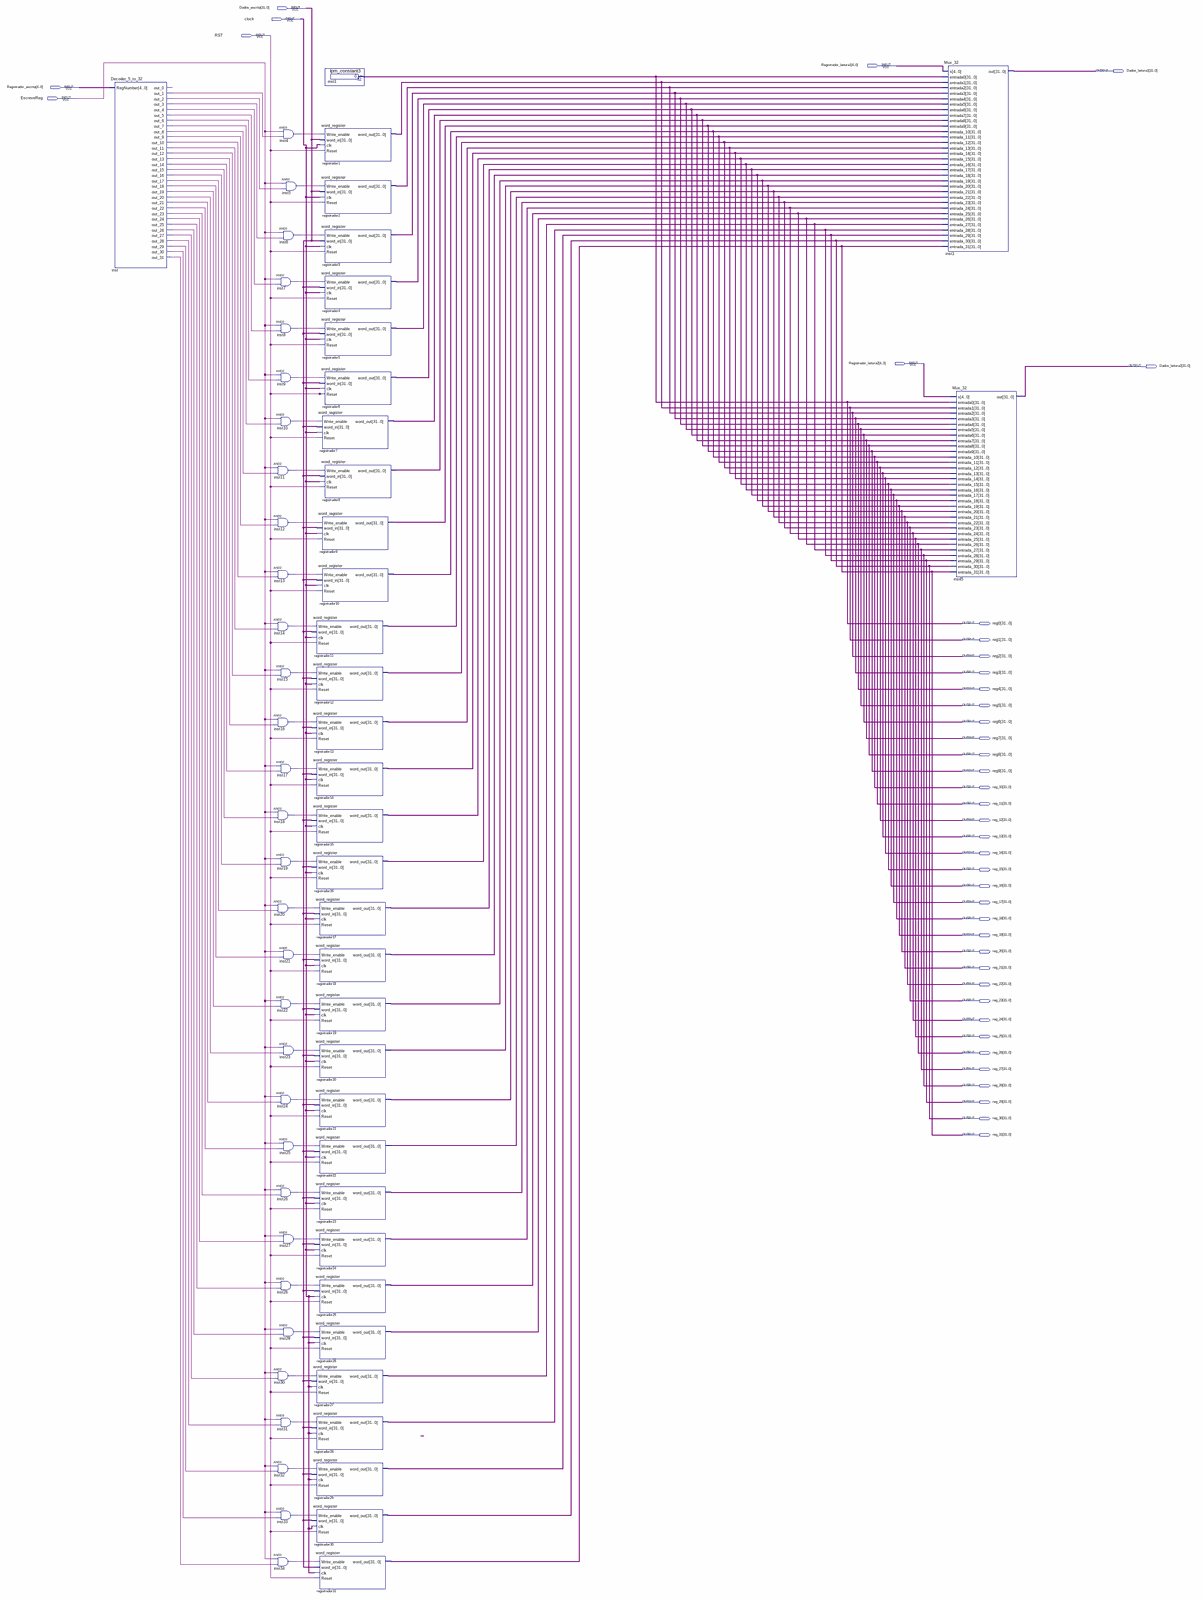
[diagram p0: schematic sheet, whole]
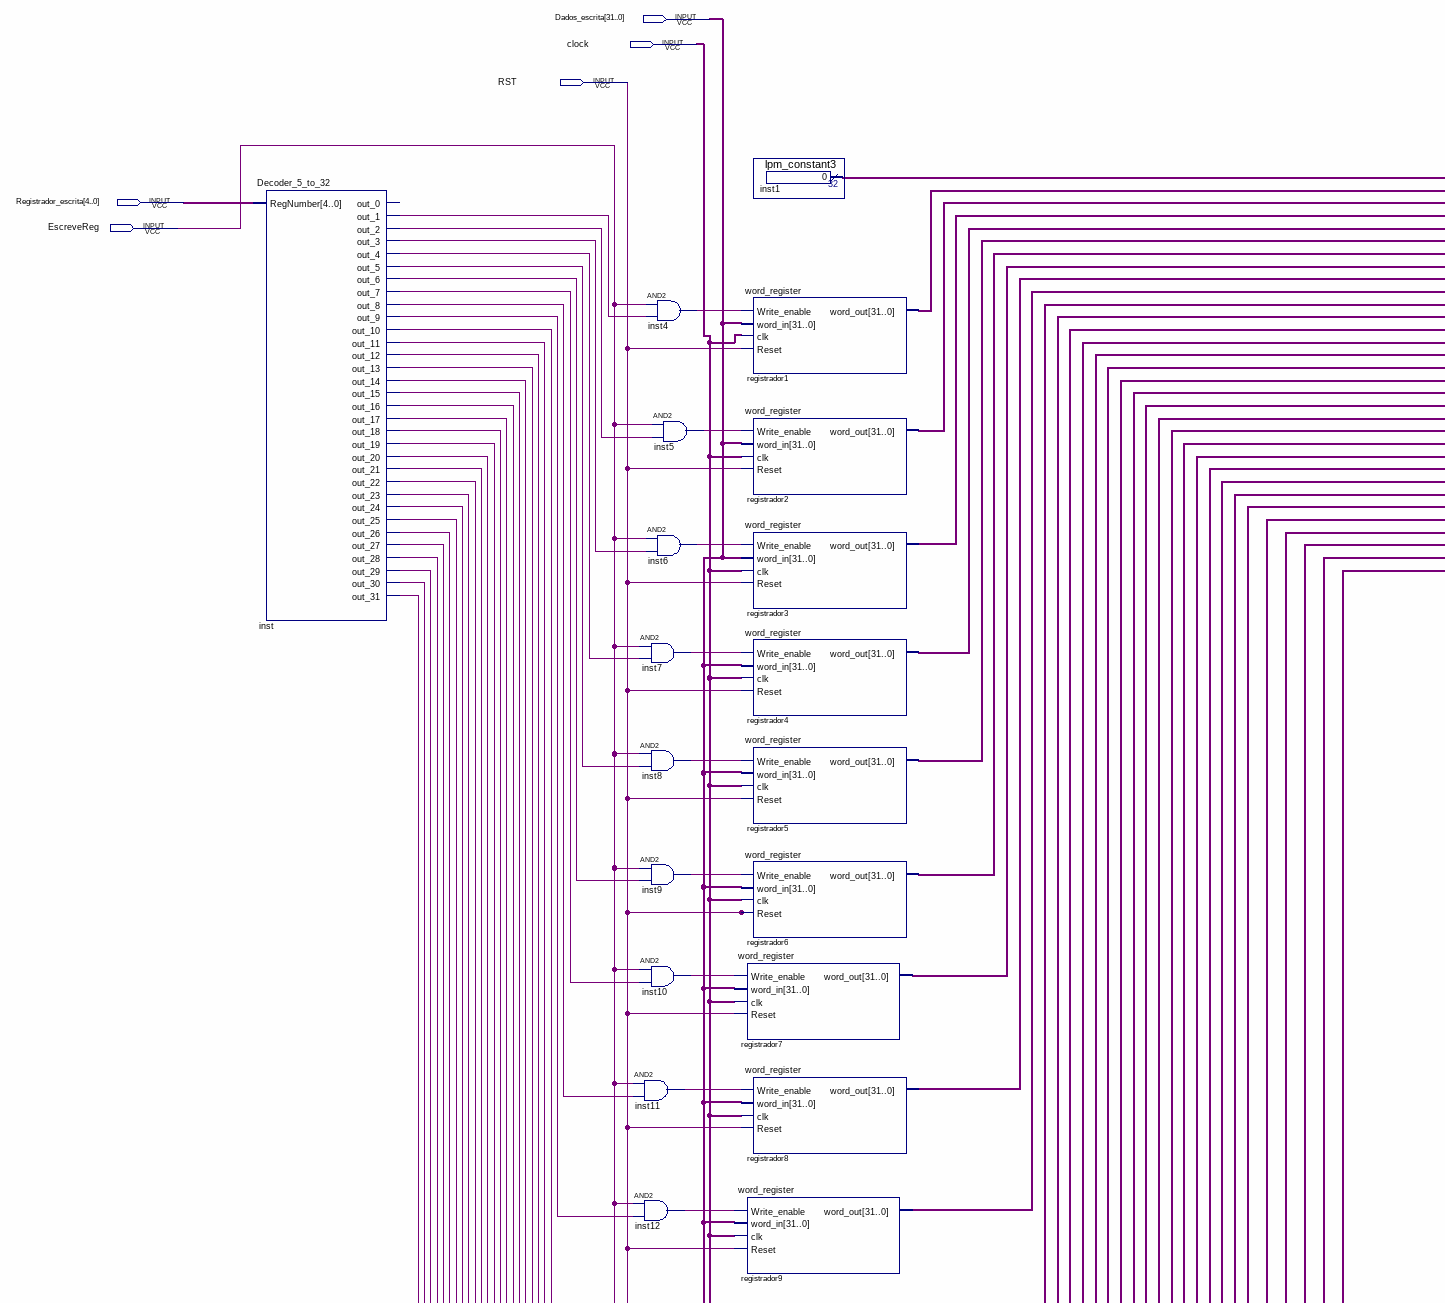
[diagram p1: schematic sheet, upper left part]
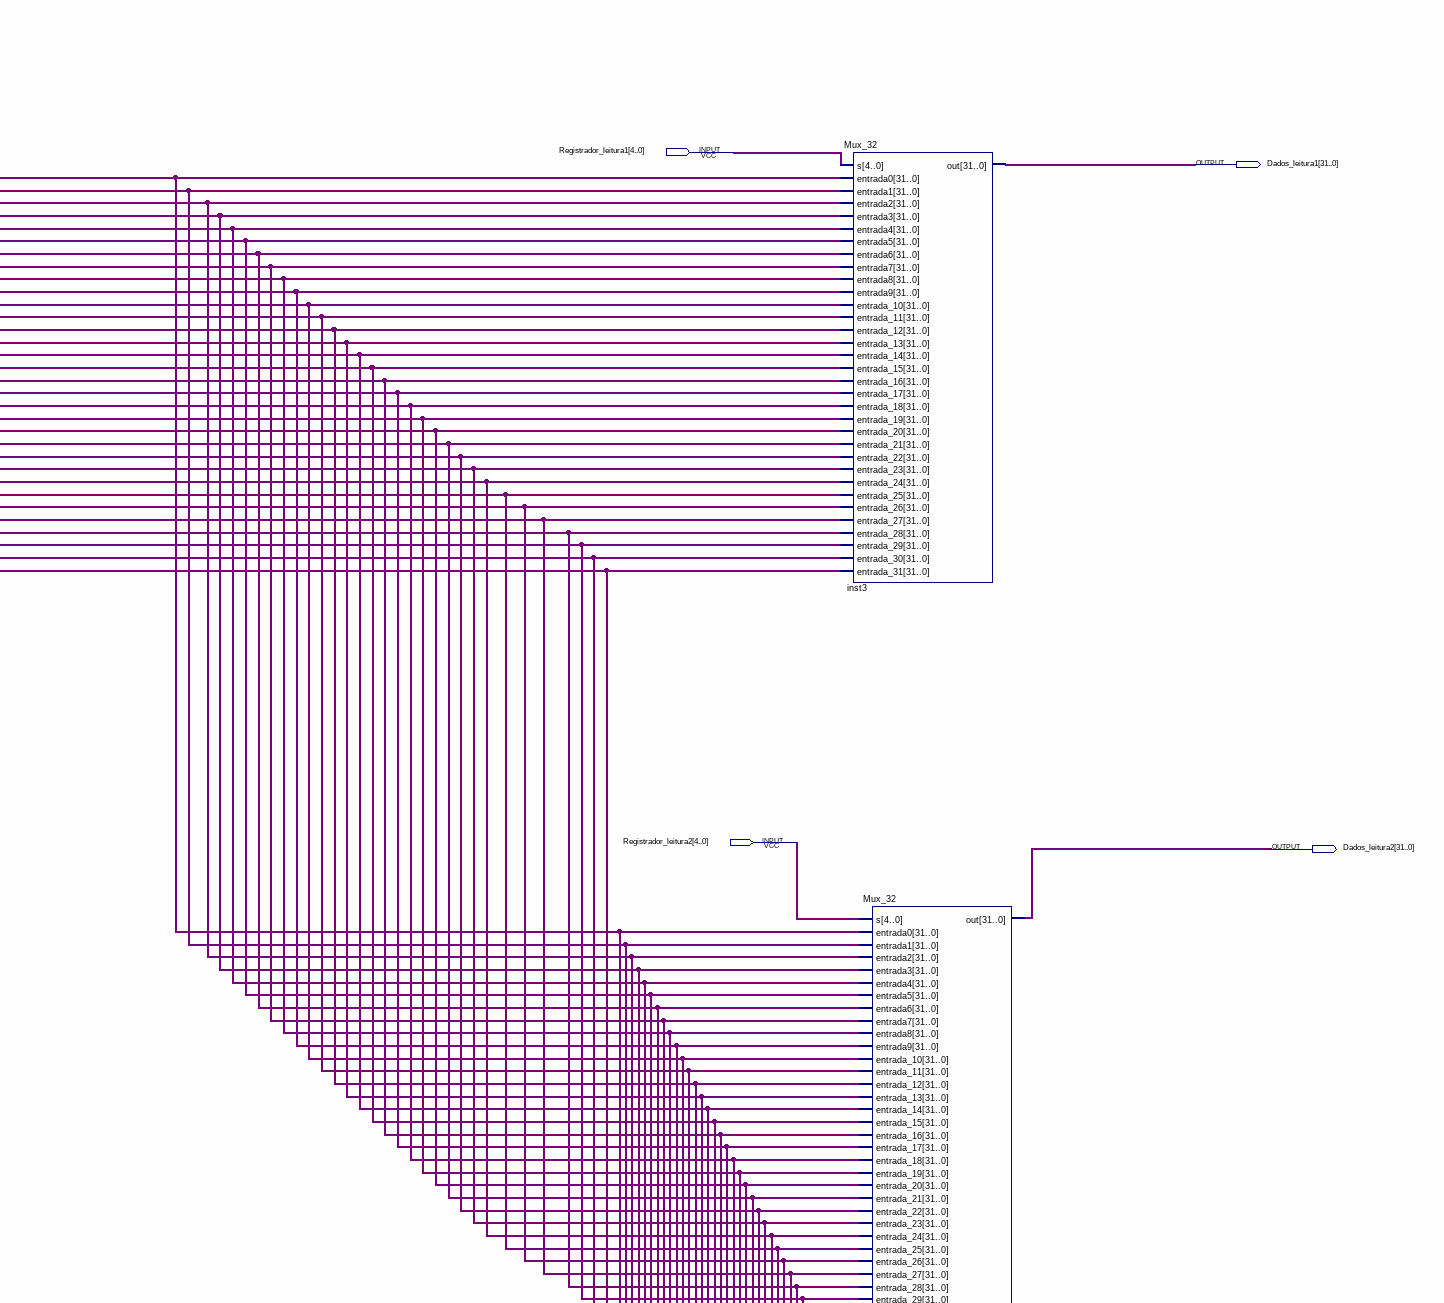
[diagram p2: schematic sheet, upper right part]
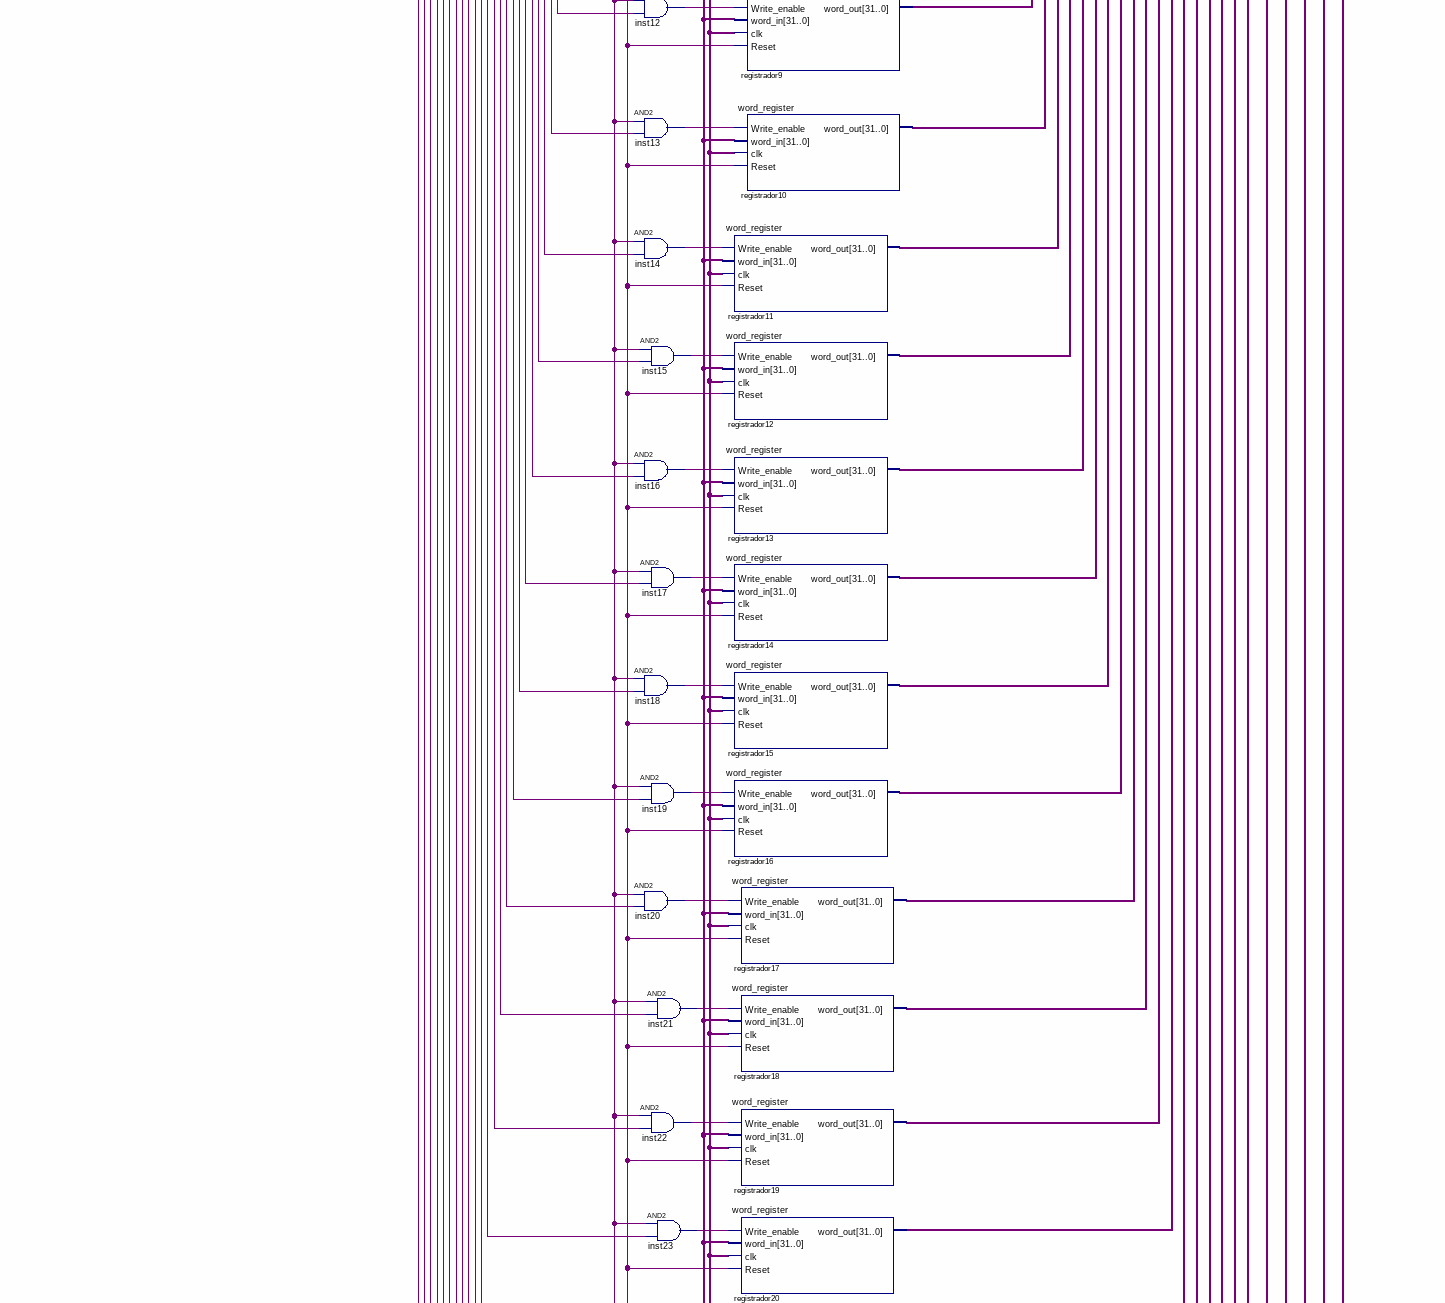
[diagram p3: schematic sheet, middle left part]
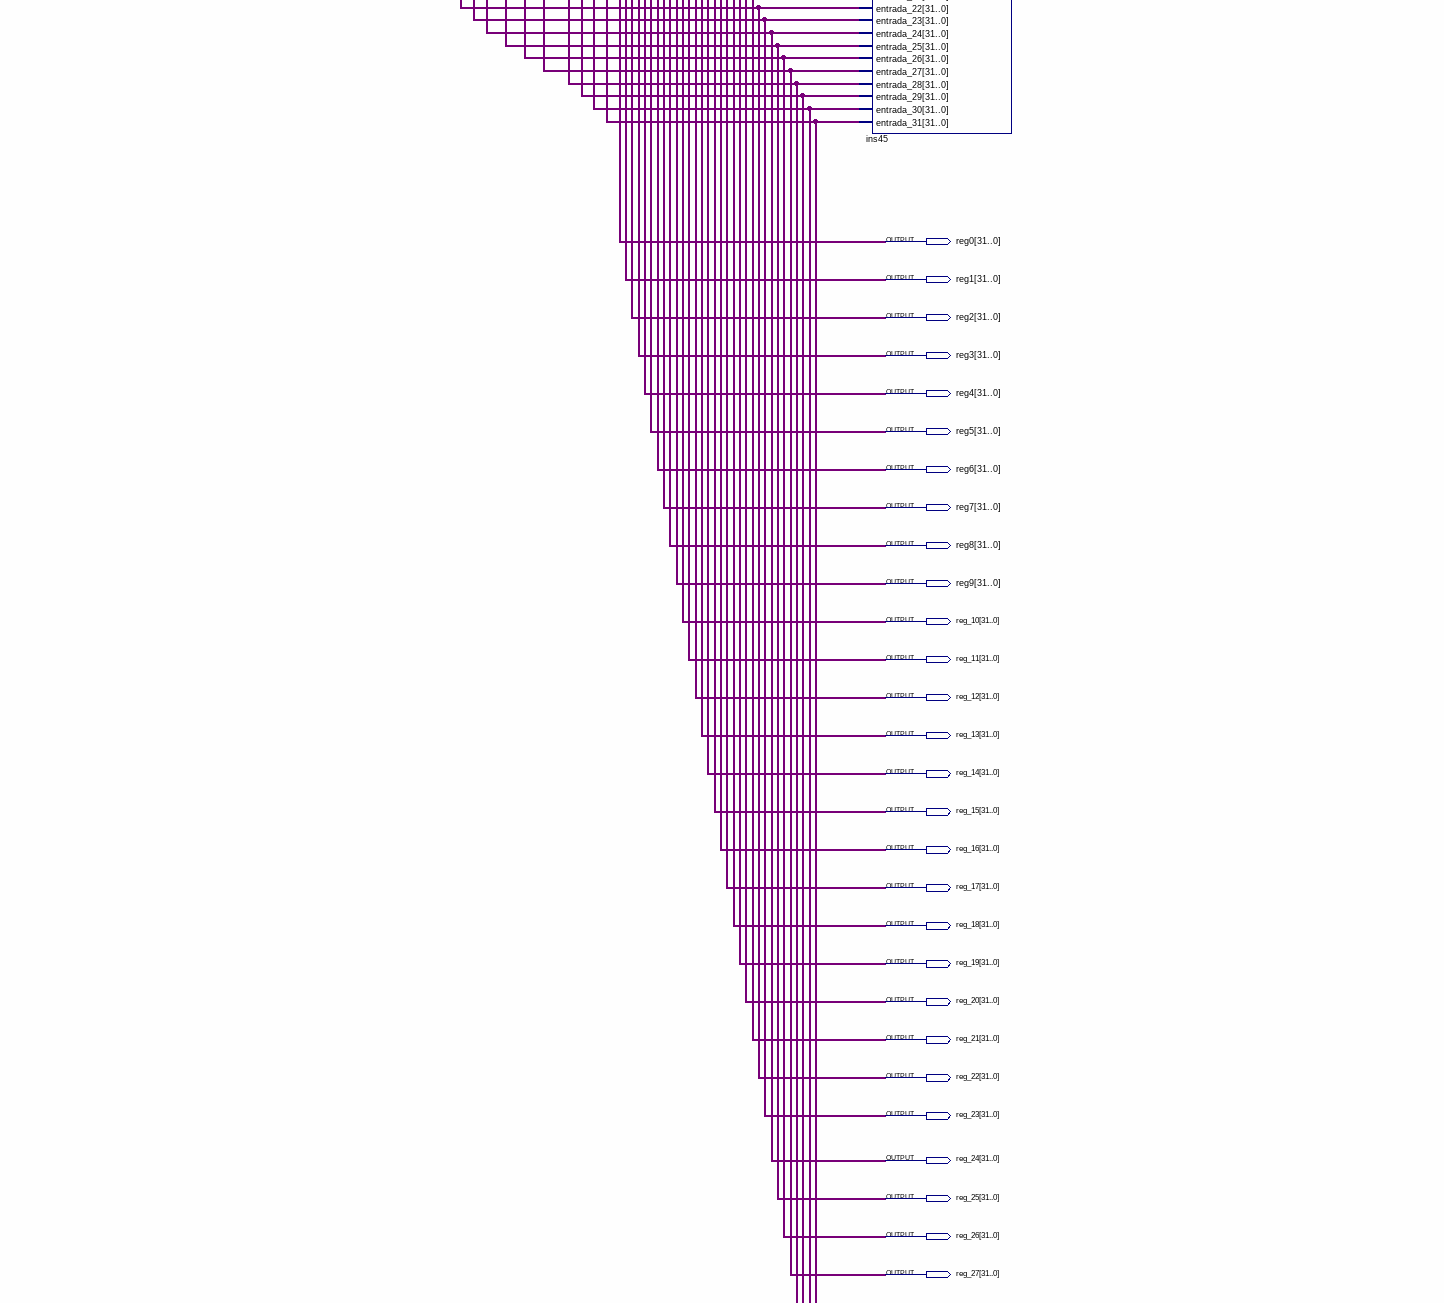
[diagram p4: schematic sheet, middle right part]
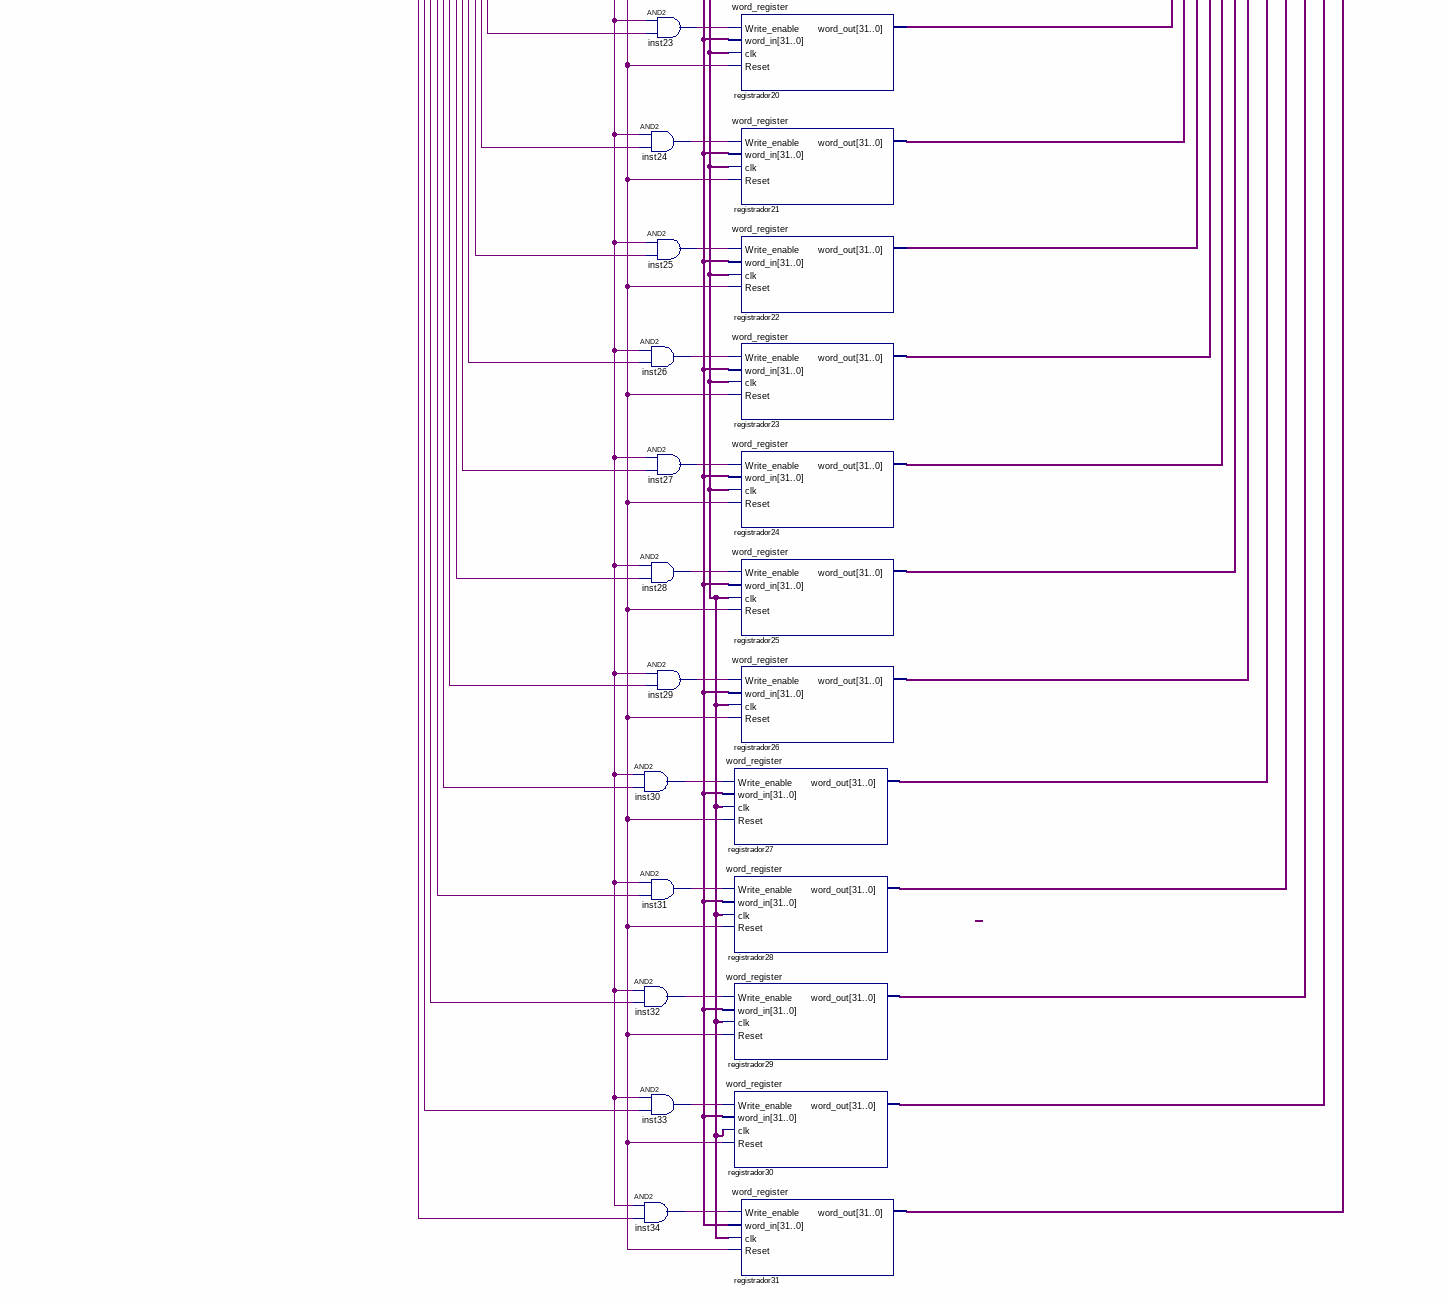
[diagram p5: schematic sheet, lower left part]
// Quartus schematic Banco_de_registradores.bdf as structural Verilog: 66 symbols, 41 pins
module Banco_de_registradores (
  input  [31:0] Dados_escrita,
  input  clock,
  input  RST,
  input  [4:0] Registrador_leitura1,
  input  [4:0] Registrador_escrita,
  input  EscreveReg,
  input  [4:0] Registrador_leitura2,
  output [31:0] Dados_leitura1,
  output [31:0] Dados_leitura2,
  output [31:0] reg0,
  output [31:0] reg1,
  output [31:0] reg2,
  output [31:0] reg3,
  output [31:0] reg4,
  output [31:0] reg5,
  output [31:0] reg6,
  output [31:0] reg7,
  output [31:0] reg8,
  output [31:0] reg9,
  output [31:0] reg_10,
  output [31:0] reg_11,
  output [31:0] reg_12,
  output [31:0] reg_13,
  output [31:0] reg_14,
  output [31:0] reg_15,
  output [31:0] reg_16,
  output [31:0] reg_17,
  output [31:0] reg_18,
  output [31:0] reg_19,
  output [31:0] reg_20,
  output [31:0] reg_21,
  output [31:0] reg_22,
  output [31:0] reg_23,
  output [31:0] reg_24,
  output [31:0] reg_25,
  output [31:0] reg_26,
  output [31:0] reg_27,
  output [31:0] reg_28,
  output [31:0] reg_29,
  output [31:0] reg_30,
  output [31:0] reg_31
);

  wire inst4_out, inst5_out, inst6_out, inst7_out, inst8_out, inst9_out, inst10_out, inst11_out, inst12_out,
       inst13_out, inst14_out, inst15_out, inst16_out, inst17_out, inst18_out, inst19_out, inst20_out,
       inst21_out, inst22_out, inst23_out, inst24_out, inst25_out, inst26_out, inst27_out, inst28_out,
       inst29_out, inst30_out, inst31_out, inst32_out, inst33_out, inst34_out, inst_out_1, inst_out_2,
       inst_out_3, inst_out_4, inst_out_5, inst_out_6, inst_out_7, inst_out_8, inst_out_9, inst_out_10,
       inst_out_11, inst_out_12, inst_out_13, inst_out_14, inst_out_15, inst_out_16, inst_out_17,
       inst_out_18, inst_out_19, inst_out_20, inst_out_21, inst_out_22, inst_out_23, inst_out_24,
       inst_out_25, inst_out_26, inst_out_27, inst_out_28, inst_out_29, inst_out_30, inst_out_31;

  Decoder_5_to_32 inst (
    .RegNumber(Registrador_escrita), .out_1(inst_out_1), .out_2(inst_out_2), .out_3(inst_out_3),
    .out_4(inst_out_4), .out_5(inst_out_5), .out_6(inst_out_6), .out_7(inst_out_7), .out_8(inst_out_8),
    .out_9(inst_out_9), .out_10(inst_out_10), .out_11(inst_out_11), .out_12(inst_out_12),
    .out_13(inst_out_13), .out_14(inst_out_14), .out_15(inst_out_15), .out_16(inst_out_16),
    .out_17(inst_out_17), .out_18(inst_out_18), .out_19(inst_out_19), .out_20(inst_out_20),
    .out_21(inst_out_21), .out_22(inst_out_22), .out_23(inst_out_23), .out_24(inst_out_24),
    .out_25(inst_out_25), .out_26(inst_out_26), .out_27(inst_out_27), .out_28(inst_out_28),
    .out_29(inst_out_29), .out_30(inst_out_30), .out_31(inst_out_31));  // open: out_0
  and inst4 (inst4_out, EscreveReg, inst_out_1);
  and inst5 (inst5_out, EscreveReg, inst_out_2);
  and inst6 (inst6_out, EscreveReg, inst_out_3);
  and inst7 (inst7_out, EscreveReg, inst_out_4);
  and inst8 (inst8_out, EscreveReg, inst_out_5);
  and inst9 (inst9_out, EscreveReg, inst_out_6);
  and inst10 (inst10_out, EscreveReg, inst_out_7);
  and inst11 (inst11_out, EscreveReg, inst_out_8);
  and inst12 (inst12_out, EscreveReg, inst_out_9);
  and inst13 (inst13_out, EscreveReg, inst_out_10);
  and inst14 (inst14_out, EscreveReg, inst_out_11);
  and inst15 (inst15_out, EscreveReg, inst_out_12);
  and inst16 (inst16_out, EscreveReg, inst_out_13);
  and inst17 (inst17_out, EscreveReg, inst_out_14);
  and inst18 (inst18_out, EscreveReg, inst_out_15);
  and inst19 (inst19_out, EscreveReg, inst_out_16);
  and inst20 (inst20_out, EscreveReg, inst_out_17);
  and inst21 (inst21_out, EscreveReg, inst_out_18);
  and inst22 (inst22_out, EscreveReg, inst_out_19);
  and inst23 (inst23_out, EscreveReg, inst_out_20);
  and inst24 (inst24_out, EscreveReg, inst_out_21);
  and inst25 (inst25_out, EscreveReg, inst_out_22);
  and inst26 (inst26_out, EscreveReg, inst_out_23);
  and inst27 (inst27_out, EscreveReg, inst_out_24);
  and inst28 (inst28_out, EscreveReg, inst_out_25);
  and inst29 (inst29_out, EscreveReg, inst_out_26);
  and inst30 (inst30_out, EscreveReg, inst_out_27);
  and inst31 (inst31_out, EscreveReg, inst_out_28);
  and inst32 (inst32_out, EscreveReg, inst_out_29);
  and inst33 (inst33_out, EscreveReg, inst_out_30);
  and inst34 (inst34_out, EscreveReg, inst_out_31);
  lpm_constant3 inst1 (.result(reg0));
  word_register registrador1 (
    .Write_enable(inst4_out), .word_in(Dados_escrita), .clk(clock), .Reset(RST), .word_out(reg1));
  word_register registrador2 (
    .Write_enable(inst5_out), .word_in(Dados_escrita), .clk(clock), .Reset(RST), .word_out(reg2));
  word_register registrador3 (
    .Write_enable(inst6_out), .word_in(Dados_escrita), .clk(clock), .Reset(RST), .word_out(reg3));
  word_register registrador4 (
    .Write_enable(inst7_out), .word_in(Dados_escrita), .clk(clock), .Reset(RST), .word_out(reg4));
  word_register registrador5 (
    .Write_enable(inst8_out), .word_in(Dados_escrita), .clk(clock), .Reset(RST), .word_out(reg5));
  word_register registrador6 (
    .Write_enable(inst9_out), .word_in(Dados_escrita), .clk(clock), .Reset(RST), .word_out(reg6));
  word_register registrador7 (
    .Write_enable(inst10_out), .word_in(Dados_escrita), .clk(clock), .Reset(RST), .word_out(reg7));
  word_register registrador8 (
    .Write_enable(inst11_out), .word_in(Dados_escrita), .clk(clock), .Reset(RST), .word_out(reg8));
  word_register registrador9 (
    .Write_enable(inst12_out), .word_in(Dados_escrita), .clk(clock), .Reset(RST), .word_out(reg9));
  word_register registrador10 (
    .Write_enable(inst13_out), .word_in(Dados_escrita), .clk(clock), .Reset(RST), .word_out(reg_10));
  word_register registrador11 (
    .Write_enable(inst14_out), .word_in(Dados_escrita), .clk(clock), .Reset(RST), .word_out(reg_11));
  word_register registrador12 (
    .Write_enable(inst15_out), .word_in(Dados_escrita), .clk(clock), .Reset(RST), .word_out(reg_12));
  word_register registrador13 (
    .Write_enable(inst16_out), .word_in(Dados_escrita), .clk(clock), .Reset(RST), .word_out(reg_13));
  word_register registrador14 (
    .Write_enable(inst17_out), .word_in(Dados_escrita), .clk(clock), .Reset(RST), .word_out(reg_14));
  word_register registrador15 (
    .Write_enable(inst18_out), .word_in(Dados_escrita), .clk(clock), .Reset(RST), .word_out(reg_15));
  word_register registrador16 (
    .Write_enable(inst19_out), .word_in(Dados_escrita), .clk(clock), .Reset(RST), .word_out(reg_16));
  word_register registrador17 (
    .Write_enable(inst20_out), .word_in(Dados_escrita), .clk(clock), .Reset(RST), .word_out(reg_17));
  word_register registrador18 (
    .Write_enable(inst21_out), .word_in(Dados_escrita), .clk(clock), .Reset(RST), .word_out(reg_18));
  word_register registrador19 (
    .Write_enable(inst22_out), .word_in(Dados_escrita), .clk(clock), .Reset(RST), .word_out(reg_19));
  word_register registrador20 (
    .Write_enable(inst23_out), .word_in(Dados_escrita), .clk(clock), .Reset(RST), .word_out(reg_20));
  word_register registrador21 (
    .Write_enable(inst24_out), .word_in(Dados_escrita), .clk(clock), .Reset(RST), .word_out(reg_21));
  word_register registrador22 (
    .Write_enable(inst25_out), .word_in(Dados_escrita), .clk(clock), .Reset(RST), .word_out(reg_22));
  word_register registrador23 (
    .Write_enable(inst26_out), .word_in(Dados_escrita), .clk(clock), .Reset(RST), .word_out(reg_23));
  word_register registrador24 (
    .Write_enable(inst27_out), .word_in(Dados_escrita), .clk(clock), .Reset(RST), .word_out(reg_24));
  word_register registrador25 (
    .Write_enable(inst28_out), .word_in(Dados_escrita), .clk(clock), .Reset(RST), .word_out(reg_25));
  word_register registrador26 (
    .Write_enable(inst29_out), .word_in(Dados_escrita), .clk(clock), .Reset(RST), .word_out(reg_26));
  word_register registrador27 (
    .Write_enable(inst30_out), .word_in(Dados_escrita), .clk(clock), .Reset(RST), .word_out(reg_27));
  word_register registrador28 (
    .Write_enable(inst31_out), .word_in(Dados_escrita), .clk(clock), .Reset(RST), .word_out(reg_28));
  word_register registrador29 (
    .Write_enable(inst32_out), .word_in(Dados_escrita), .clk(clock), .Reset(RST), .word_out(reg_29));
  word_register registrador30 (
    .Write_enable(inst33_out), .word_in(Dados_escrita), .clk(clock), .Reset(RST), .word_out(reg_30));
  word_register registrador31 (
    .Write_enable(inst34_out), .word_in(Dados_escrita), .clk(clock), .Reset(RST), .word_out(reg_31));
  Mux_32 inst3 (
    .s(Registrador_leitura1), .entrada0(reg0), .entrada1(reg1), .entrada2(reg2), .entrada3(reg3),
    .entrada4(reg4), .entrada5(reg5), .entrada6(reg6), .entrada7(reg7), .entrada8(reg8), .entrada9(reg9),
    .entrada_10(reg_10), .entrada_11(reg_11), .entrada_12(reg_12), .entrada_13(reg_13), .entrada_14(reg_14),
    .entrada_15(reg_15), .entrada_16(reg_16), .entrada_17(reg_17), .entrada_18(reg_18), .entrada_19(reg_19),
    .entrada_20(reg_20), .entrada_21(reg_21), .entrada_22(reg_22), .entrada_23(reg_23), .entrada_24(reg_24),
    .entrada_25(reg_25), .entrada_26(reg_26), .entrada_27(reg_27), .entrada_28(reg_28), .entrada_29(reg_29),
    .entrada_30(reg_30), .entrada_31(reg_31), .out(Dados_leitura1));
  Mux_32 ins45 (
    .s(Registrador_leitura2), .entrada0(reg0), .entrada1(reg1), .entrada2(reg2), .entrada3(reg3),
    .entrada4(reg4), .entrada5(reg5), .entrada6(reg6), .entrada7(reg7), .entrada8(reg8), .entrada9(reg9),
    .entrada_10(reg_10), .entrada_11(reg_11), .entrada_12(reg_12), .entrada_13(reg_13), .entrada_14(reg_14),
    .entrada_15(reg_15), .entrada_16(reg_16), .entrada_17(reg_17), .entrada_18(reg_18), .entrada_19(reg_19),
    .entrada_20(reg_20), .entrada_21(reg_21), .entrada_22(reg_22), .entrada_23(reg_23), .entrada_24(reg_24),
    .entrada_25(reg_25), .entrada_26(reg_26), .entrada_27(reg_27), .entrada_28(reg_28), .entrada_29(reg_29),
    .entrada_30(reg_30), .entrada_31(reg_31), .out(Dados_leitura2));
endmodule
